# Altium project FiltroBA.PrjPCB
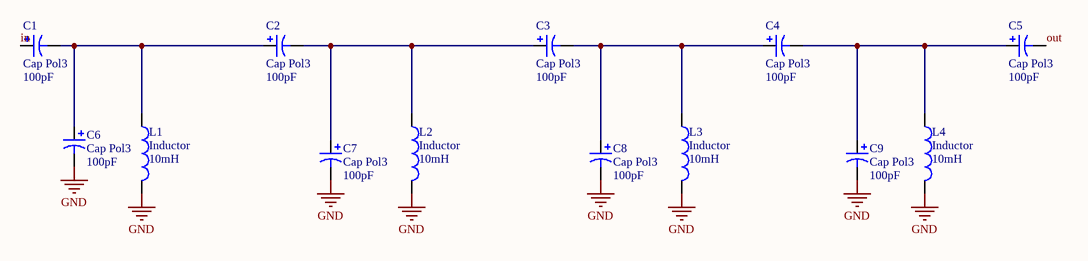
[diagram p0: FiltroPB_acoplado.SchDoc]
1 sheet, 13 parts. Net scope: global (net labels, ports and power ports of the same name join across sheets).
Board file: filtroPB.PcbDoc

## Sheet FiltroPB_acoplado.SchDoc
size A4

### Parts
C1  Cap Pol3  value 100pF  [C0805]
C2  Cap Pol3  value 100pF  [C0805]
C3  Cap Pol3  value 100pF  [C0805]
C4  Cap Pol3  value 100pF  [C0805]
C5  Cap Pol3  value 100pF  [C0805]
C6  Cap Pol3  value 100pF  [C0805]
C7  Cap Pol3  value 100pF  [C0805]
C8  Cap Pol3  value 100pF  [C0805]
C9  Cap Pol3  value 100pF  [C0805]
L1  Inductor  value 10mH  [0402-A]
L2  Inductor  value 10mH  [0402-A]
L3  Inductor  value 10mH  [0402-A]
L4  Inductor  value 10mH  [0402-A]

### Nets
GND: C6.2 C7.2 C8.2 C9.2 L1.2 L2.2 L3.2 L4.2
in: C1.1
out: C5.2
NetC1_2: C1.2 C2.1 C6.1 L1.1
NetC2_2: C2.2 C3.1 C7.1 L2.1
NetC3_2: C3.2 C4.1 C8.1 L3.1
NetC4_2: C4.2 C5.1 C9.1 L4.1

### Library data of the parts
C1-C9 = Cap Pol3: Polarized Capacitor (Surface Mount); Published: 8-Jun-2000; LatestRevisionDate: 17-Jul-2002; LatestRevisionNote: Re-released for DXP Platform.; PackageReference: C0805; Publisher: Altium Limited
L1-L4 = Inductor: Code_IEC: 1005; Published: 8-Jun-2000; LatestRevisionDate: 17-Jul-2002; LatestRevisionNote: Re-released for DXP Platform.; PackageReference: 0402-A; Publisher: Altium Limited; Code_JEITA: 0402